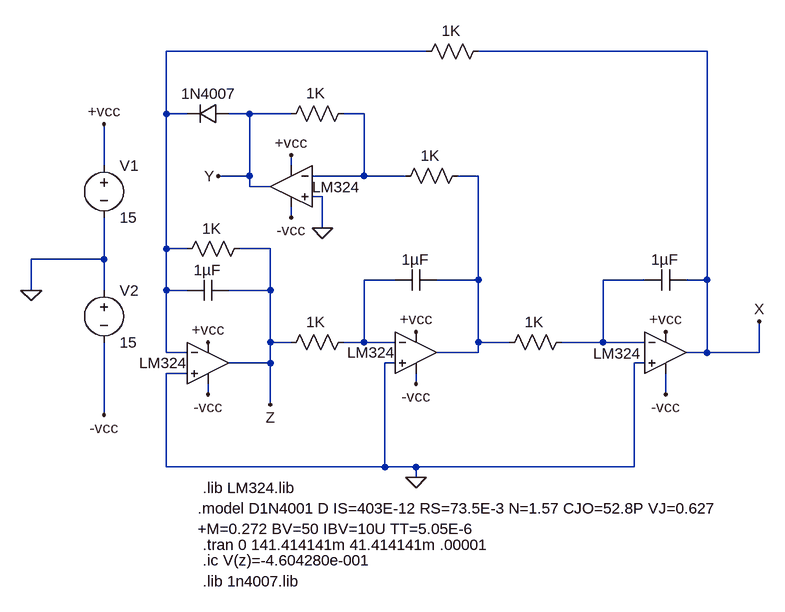
[diagram p0: schematic Jerk.asc]
Jerk.asc, the LTspice schematic file:
Version 4
SHEET 1 1016 864
WIRE 432 0 32 0
WIRE 864 0 512 0
WIRE 32 96 32 0
WIRE 64 96 32 96
WIRE 160 96 128 96
WIRE 224 96 160 96
WIRE 336 96 304 96
WIRE -64 176 -64 112
WIRE 224 176 224 160
WIRE 160 192 160 96
WIRE 160 192 112 192
WIRE 336 192 336 96
WIRE 336 192 256 192
WIRE 400 192 336 192
WIRE 512 192 480 192
WIRE 160 208 160 192
WIRE 192 208 160 208
WIRE 272 224 256 224
WIRE 224 256 224 240
WIRE 272 272 272 224
WIRE 32 304 32 96
WIRE 64 304 32 304
WIRE 192 304 144 304
WIRE -64 320 -64 256
WIRE -64 320 -176 320
WIRE 384 352 336 352
WIRE 512 352 512 192
WIRE 512 352 448 352
WIRE 768 352 704 352
WIRE 864 352 864 0
WIRE 864 352 832 352
WIRE -176 368 -176 320
WIRE -64 368 -64 320
WIRE 32 368 32 304
WIRE 64 368 32 368
WIRE 192 368 192 304
WIRE 192 368 128 368
WIRE 192 448 192 368
WIRE 224 448 192 448
WIRE 336 448 336 352
WIRE 336 448 304 448
WIRE 384 448 336 448
WIRE 512 448 512 352
WIRE 560 448 512 448
WIRE 704 448 704 352
WIRE 704 448 640 448
WIRE 768 448 704 448
WIRE 32 464 32 368
WIRE 64 464 32 464
WIRE 512 464 512 448
WIRE 512 464 448 464
WIRE 864 464 864 352
WIRE 864 464 832 464
WIRE 944 464 944 416
WIRE 944 464 864 464
WIRE 192 480 192 448
WIRE 192 480 128 480
WIRE 384 480 368 480
WIRE 768 480 752 480
WIRE 64 496 32 496
WIRE 416 512 416 496
WIRE 96 528 96 512
WIRE 800 528 800 496
WIRE 192 544 192 480
WIRE -64 560 -64 448
WIRE 32 640 32 496
WIRE 368 640 368 480
WIRE 368 640 32 640
WIRE 416 640 368 640
WIRE 752 640 752 480
WIRE 752 640 416 640
WIRE 416 656 416 640
FLAG 272 272 0
FLAG 416 656 0
FLAG 224 160 +vcc
FLAG 96 448 +vcc
FLAG 416 432 +vcc
FLAG 800 432 +vcc
FLAG 96 528 -vcc
FLAG 416 512 -vcc
FLAG 800 528 -vcc
FLAG 224 256 -vcc
FLAG -64 560 -vcc
FLAG -64 112 +vcc
FLAG -176 368 0
FLAG 944 416 X
FLAG 112 192 Y
FLAG 192 544 Z
SYMBOL res 528 -16 R90
WINDOW 0 0 56 Invisible 2
WINDOW 3 -31 58 VTop 2
SYMATTR InstName R1
SYMATTR Value 1K
SYMBOL diode 128 80 R90
WINDOW 0 0 32 Invisible 2
WINDOW 3 -30 31 VTop 2
SYMATTR InstName D1
SYMATTR Value 1N4007
SYMBOL res 320 80 R90
WINDOW 0 0 56 Invisible 2
WINDOW 3 -31 58 VTop 2
SYMATTR InstName R2
SYMATTR Value 1K
SYMBOL Opamps\\opamp2 224 144 M0
WINDOW 0 16 32 Invisible 2
WINDOW 3 -107 65 Left 2
SYMATTR InstName U1
SYMATTR Value LM324
SYMBOL res 496 176 R90
WINDOW 0 0 56 Invisible 2
WINDOW 3 -31 58 VTop 2
SYMATTR InstName R3
SYMATTR Value 1K
SYMBOL res 160 288 R90
WINDOW 0 0 56 Invisible 2
WINDOW 3 -31 58 VTop 2
SYMATTR InstName R4
SYMATTR Value 1K
SYMBOL cap 128 352 R90
WINDOW 0 0 32 Invisible 2
WINDOW 3 -31 33 VTop 2
SYMATTR InstName C1
SYMATTR Value 1µF
SYMBOL Opamps\\opamp2 96 416 R0
WINDOW 0 16 32 Invisible 2
WINDOW 3 -106 64 Left 2
SYMATTR InstName U2
SYMATTR Value LM324
SYMBOL res 320 432 R90
WINDOW 0 0 56 Invisible 2
WINDOW 3 -31 58 VTop 2
SYMATTR InstName R5
SYMATTR Value 1K
SYMBOL Opamps\\opamp2 416 400 R0
WINDOW 0 16 32 Invisible 2
WINDOW 3 -106 64 Left 2
SYMATTR InstName U3
SYMATTR Value LM324
SYMBOL cap 448 336 R90
WINDOW 0 0 32 Invisible 2
WINDOW 3 -31 33 VTop 2
SYMATTR InstName C2
SYMATTR Value 1µF
SYMBOL res 656 432 R90
WINDOW 0 0 56 Invisible 2
WINDOW 3 -31 58 VTop 2
SYMATTR InstName R6
SYMATTR Value 1K
SYMBOL cap 832 336 R90
WINDOW 0 0 32 Invisible 2
WINDOW 3 -31 33 VTop 2
SYMATTR InstName C3
SYMATTR Value 1µF
SYMBOL Opamps\\opamp2 800 400 R0
WINDOW 0 16 32 Invisible 2
WINDOW 3 -111 65 Left 2
SYMATTR InstName U4
SYMATTR Value LM324
SYMBOL voltage -64 160 R0
SYMATTR InstName V1
SYMATTR Value 15
SYMBOL voltage -64 352 R0
SYMATTR InstName V2
SYMATTR Value 15
TEXT 88 672 Left 2 !.lib LM324.lib
TEXT 80 704 Left 2 !.model D1N4001 D IS=403E-12 RS=73.5E-3 N=1.57 CJO=52.8P VJ=0.627\n+M=0.272 BV=50 IBV=10U TT=5.05E-6
TEXT 88 760 Left 2 !.tran 0 141.414141m 41.414141m .00001
TEXT 88 784 Left 2 !.ic V(z)=-4.604280e-001
TEXT 88 816 Left 2 !.lib 1n4007.lib

The netlist it stands for:
* Jerk.asc
R1 X N001 1K
D1 Y N001 1N4007
R2 N002 Y 1K
XU1 0 N002 +vcc -vcc Y LM324  ; pins In+ In- V+ V- OUT
R3 N003 N002 1K
R4 Z N001 1K
C1 Z N001 1µF
XU2 0 N001 +vcc -vcc Z LM324  ; pins In+ In- V+ V- OUT
R5 N004 Z 1K
XU3 0 N004 +vcc -vcc N003 LM324  ; pins In+ In- V+ V- OUT
C2 N003 N004 1µF
R6 N005 N003 1K
C3 X N005 1µF
XU4 0 N005 +vcc -vcc X LM324  ; pins In+ In- V+ V- OUT
V1 +vcc 0 15
V2 0 -vcc 15
.model D D
.lib standard.dio
.lib LM324.lib
.model D1N4001 D IS=403E-12 RS=73.5E-3 N=1.57 CJO=52.8P VJ=0.627
+M=0.272 BV=50 IBV=10U TT=5.05E-6
.tran 0 141.414141m 41.414141m .00001
.ic V(z)=-4.604280e-001
.lib 1n4007.lib
.backanno
.end